# EAGLE design working (EAGLE 9.6.2)
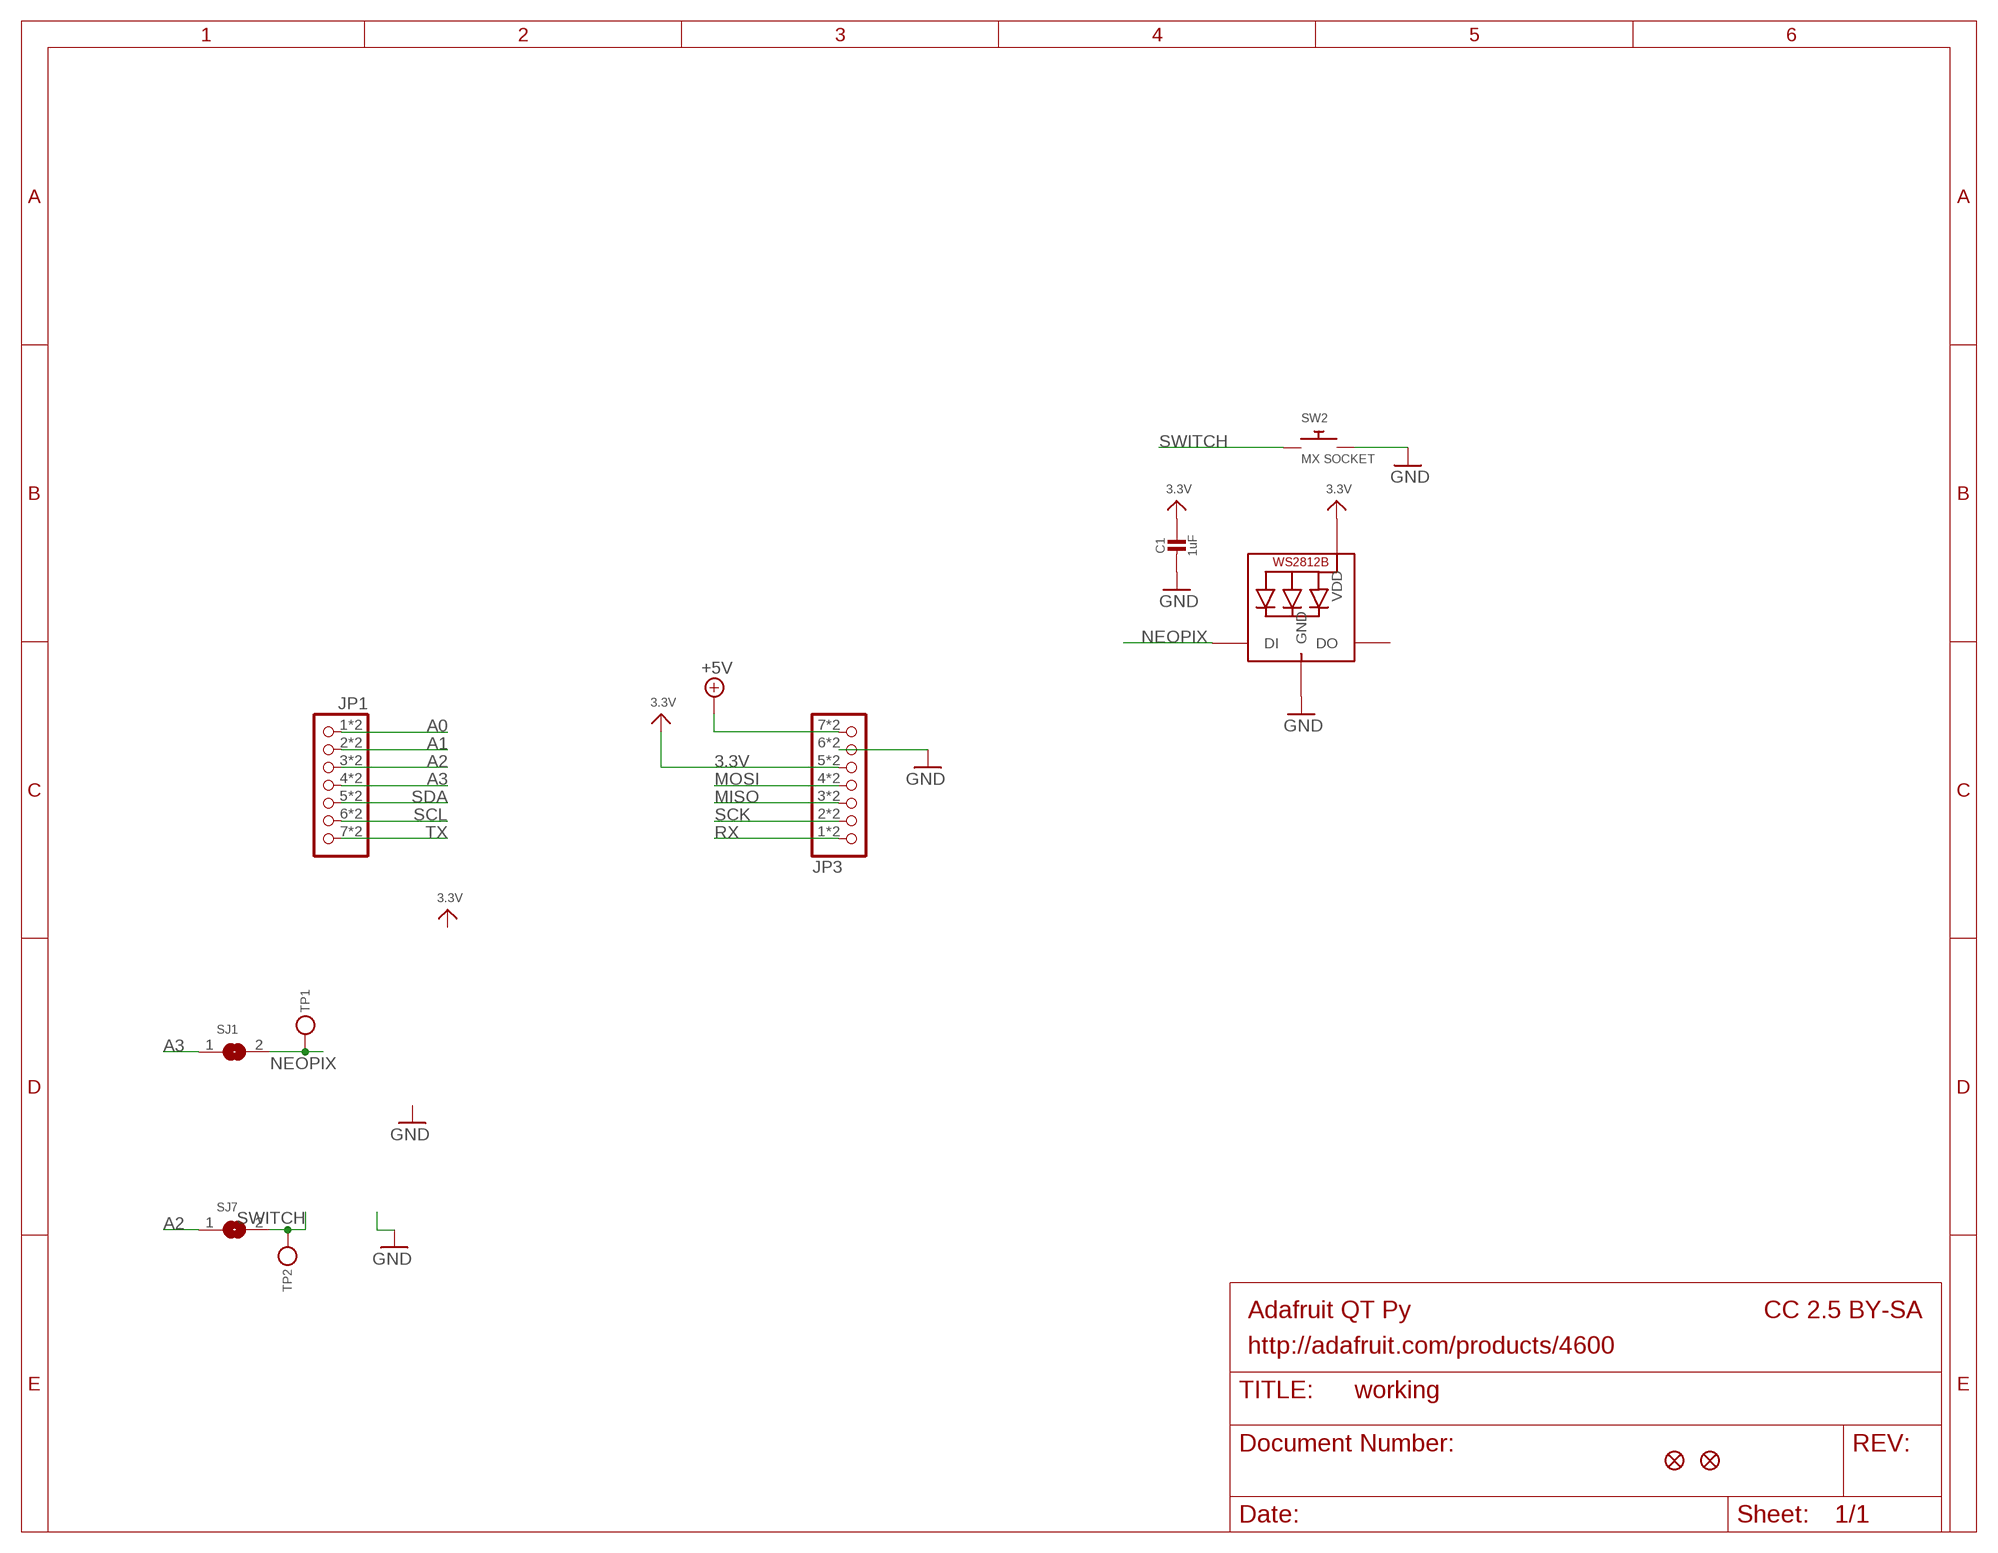
[diagram p0: schematic, sheet 1]

## Parts
C1  1uF  CAP_CERAMIC0603_NO  [0603-NO]
JP1  HEADER-1X7_CASTEL  [1X07_CASTEL]
JP3  HEADER-1X7_CASTEL  [1X07_CASTEL]
LED2  WS2812B_SK6812E  [NEO3535_REVERSE]
SJ1  SOLDERJUMPERCLOSED  [SOLDERJUMPER_CLOSEDWIRE]
SJ7  SOLDERJUMPERCLOSED  [SOLDERJUMPER_CLOSEDWIRE]
SW2  MX SOCKET  SWITCH_PUSHBUTTON_KAILH_SOCKET  [KAILH_SOCKET]
TP1  TESTPOINT1.5X2.0MM_NOCREAM  [PAD-1.5X2.0]
TP2  TESTPOINT1.5X2.0MM_NOCREAM  [PAD-1.5X2.0]
U$6  FIDUCIAL_1MM  [FIDUCIAL_1MM]
U$8  FIDUCIAL_1MM  [FIDUCIAL_1MM]

## Nets
3.3V: C1.1 JP3.5 JP3.5C LED2.1-VDD(VDD)
+5V [power]: JP3.7 JP3.7C
A0: JP1.1 JP1.1C
A1: JP1.2 JP1.2C
A2: JP1.3 JP1.3C SJ7.1
A3: JP1.4 JP1.4C SJ1.1
GND [power]: C1.2 JP3.6 JP3.6C LED2.3-GND(GND) SW2.2
MISO: JP3.3 JP3.3C
MOSI: JP3.4 JP3.4C
NEOPIX: LED2.4-DIN(DI) SJ1.2 TP1.P$1
RX: JP3.1 JP3.1C
SCK: JP3.2 JP3.2C
SCL: JP1.6 JP1.6C
SDA: JP1.5 JP1.5C
SWITCH: SJ7.2 SW2.1 TP2.P$1
TX: JP1.7 JP1.7C
Unconnected: LED2.2-DOUT(DO)

## Notes on the sheet
- Adafruit QT Py | CC 2.5 BY-SA
- http://adafruit.com/products/4600

## Library data of the parts
C1 = microbuilder:CAP_CERAMIC: Ceramic Capacitors For new designs, use the packages preceded by an '_' character since they are more reliable: The following footprints should be used on most boards: _0402 - Standard footprint for regular board layouts _0603 - Standard footprint for regular board layouts _0805 - Standard footprint for regular board layouts _1206 - Standard footprint for regular board layouts For extremely tight-pitch boards where space is at a premium, the following 'micro-pitch' footprints can be used (smaller pads, no silkscreen outline, etc.): _0402MP - Micro-pitch footprint for very dense/compact boards _0603MP - Micro-pitch footprint for very dense/compact boards _0805MP - Micro-pitch footprint for very dense/compact boards _1206MP - Micro-pitch footprint for very dense/compact boards
JP1 JP3 = adafruit_electromech:HEADER-1X7: PIN HEADER
LED2 = microbuilder:WS2812B
SJ1 SJ7 = microbuilder:SOLDERJUMPER: SMD Solder JUMPER Solder the two pads together to create a connection, or remove the solder to break it. REFLOW - Use this footprint for solder paste and reflow ovens. WAVE - Use this footprint for hand-soldering (larger pads). CLOSED - Has a trace between the two pads to ensure it is closed by default. The trace needs to be cut to disable the jumper, and can be closed again by creating a solder bridge between the two pads.
SW2 = adafruit_electromech:SWITCH_PUSHBUTTON: Buttons SOFTTOUCHSMD_SJ - Soft touch temporary push button (Super Junk Akihabara) Compatible with SKPMANE010 [Mouser: 688-SKPMAN] C&K_KSS = Digikey: KSS221GLFS; ROT: 180; XOFFSET: -.75; YOFFSET: 3.75
TP1 TP2 = microbuilder:TESTPOINT: Test Point Various test points for characterisation and PCB testing TESTPOINT_SMT - Compact Surface Mount Test Point [Digikey: 5016KTR-ND]
U$6 U$8 = microbuilder:FIDUCIAL: Fiducial Alignment Points Various fiducial points for machine vision alignment.; BOM: EXCLUDE

## Net classes
1 power: width 0.305 mm
2 thickpower: width 0.406 mm

## Board
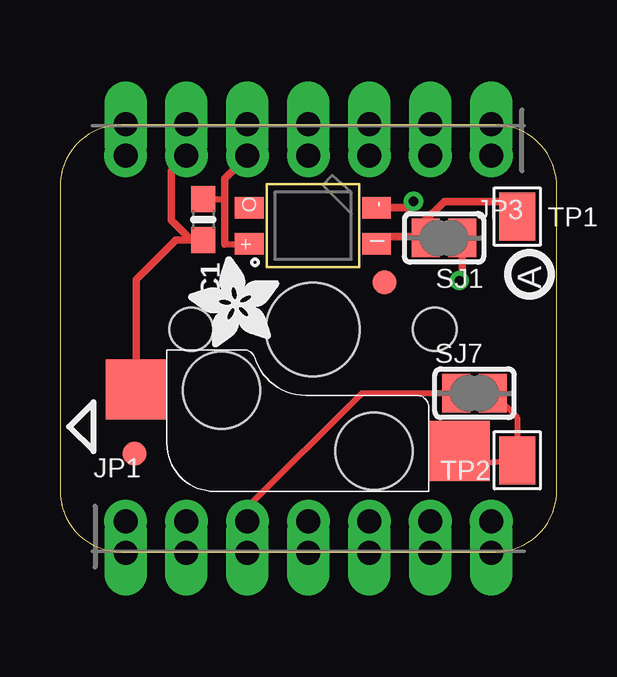
[diagram p1: board, top side]
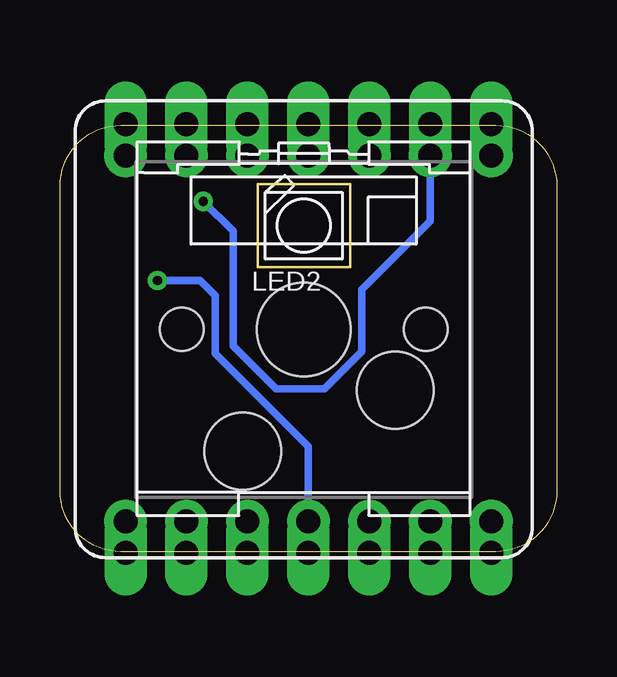
[diagram p2: board, bottom side, seen from below]

Size 20.7 x 17.78 mm. Coordinates in mm from the lower left corner, seen from the top.
Outline: 2.54,0 18.16,0 arc90 20.7,2.54 20.7,15.24 arc90 18.16,17.78 2.54,17.78 arc90 0,15.24 0,2.54 arc90 2.54,0
Copper layers (1*16): Top 0.035mm / dielectric 1.5mm / Bottom 0.035mm
Design rules "adafruit 7-7": minimum track width 7mil, minimum drill 15.5mil, track to track 7mil, track to pad 7mil, pad to pad 7mil, via to via 7mil, smd to smd 7mil, copper to edge 10mil, drill to drill 8mil, minimum pad ring 7mil, minimum via ring 8mil, stop-mask expansion 2mil, vias tented up to drill 20mil, thermal gap 10mil

### Footprints (pad centres in the part's own frame; a part is rotated, then mirrored left to right if it is on the bottom)
0603-NO = smd 1.075 x 1: 1 -0.85,0; 2 0.85,0
1X07_CASTEL = drill 1 pad 1.778: 1 -7.62,0; 2 -5.08,0; 3 -2.54,0; 4 0,0; 5 2.54,0; 6 5.08,0; 7 7.62,0 | drill 1 pad 1.778 long: 1C -7.62,-1.324; 2C -5.08,-1.324; 3C -2.54,-1.324; 4C 0,-1.324; 5C 2.54,-1.324; 6C 5.08,-1.324; 7C 7.62,-1.324
NEO3535_REVERSE = smd 1.2 x 0.9 bottom: 1-VDD 2.65,-0.75; 2-DOUT 2.65,0.75; 3-GND -2.65,0.75; 4-DIN -2.65,-0.75
SOLDERJUMPER_CLOSEDWIRE = smd 1.168 x 1.6: 1 -0.762,0; 2 0.762,0 | smd 0.635 x 0.203: WIRE 0,0
KAILH_SOCKET = smd 2.55 x 2.5 bottom: 1 6.09,5.08; 2 -7.36,2.5 | hole 3.9: 0,0 | hole 3.2: 2.54,5.08; -3.81,2.54 | hole 1.813: 5.08,0; -5.08,0
PAD-1.5X2.0 = smd 1.5 x 2: P$1 0,0
FIDUCIAL_1MM = smd 1 x 1: 1 0,0

### Placement (x,y rotation side)
C1  5.97,13.84 270 top
JP1  10.35,1.27 0 top
JP3  10.35,16.51 180 top
LED2  10.54,13.59 0 bottom
PLABEL0  [PLABEL0]  19.94,0.51 90 top
PLABEL1  [PLABEL1]  15.37,8 180 top
PLABEL2  [PLABEL2]  17.91,15.24 180 top
PLABEL3  [PLABEL3]  16.26,11.81 180 top
PLABEL4  [PLABEL4]  0.89,8.76 90 top
PLABEL5  [PLABEL5]  18.29,9.4 90 top
PLABEL6  [PLABEL6]  19.56,7.75 90 top
PLABEL7  [PLABEL7]  3.17,11.81 90 top
PLABEL8  [PLABEL8]  1.14,2.03 90 top
PLABEL9  [PLABEL9]  1.27,16.38 90 top
SJ1  16,13.08 180 top
SJ7  17.27,6.6 0 top
SW2  10.54,9.27 180 bottom
TP1  19.05,13.97 0 top
TP2  19.05,3.81 180 top
U$2  [ADAFRUIT_3.5MM]  9.14,8.51 90 top
U$3  [PCBFEAT-REV-040]  19.56,11.56 270 top
U$6  3.11,4.08 270 top
U$8  13.53,11.24 270 top

### Tracks (layer width: path | path; a pad name or v marks a point on that pad's centre or on a via)
3.3V
  Top 0.254: C1.1 6.73,14.69 6.86,14.57 6.86,12.83 7.88,12.83 LED2.1-VDD
  Top 0.305: JP3.5C JP3.5 6.86,15.56 6.86,12.83
+5V
  Top 0.305: JP3.7C JP3.7
A0
  Top 0.254: JP1.1C JP1.1
A1
  Top 0.254: JP1.2C JP1.2
A2
  Top 0.254: JP1.3C JP1.3 7.81,1.84 12.57,6.6 SJ7.1
A3  (via drill 0.39)
  Top 0.254: JP1.4C JP1.4
  Top 0.305: SJ1.1 16.76,11.43 v16.64,11.3
  Bottom 0.305: v16.64,11.3 14.86,11.3 14.22,10.67 14.22,8.25 10.35,4.38 JP1.4
GND  (via drill 0.39)
  Top 0.305: SW2.2 3.18,11.35 4.83,12.99 C1.2 5.46,12.99 4.63,13.82 4.63,15.88 JP3.6 JP3.6C | LED2.3-GND 14.47,14.34 v14.73,14.61
  Bottom 0.305: v14.73,14.61 13.49,13.36 13.49,8.58 11.69,6.79 9.69,6.79 8.13,8.35 8.13,10.92 5.27,13.78 JP3.6
MISO
  Top 0.305: JP3.3C 12.89,17.34 12.7,17.14 12.7,16.7 JP3.3
MOSI
  Top 0.305: JP3.4C JP3.4
NEOPIX
  Top 0.305: TP1.P$1 18.41,14.61 16,14.61 15.11,13.72 15.11,13.21 15.18,13.14 | 15.18,13.14 SJ1.2 | LED2.4-DIN 13.5,13.14 15.18,13.14
RX
  Top 0.305: JP3.1C JP3.1
SCK
  Top 0.305: JP3.2C JP3.2
SCL
  Top 0.254: JP1.6C JP1.6
SDA
  Top 0.254: JP1.5C 12.89,0.57 13.08,0.76 13.08,1.08 JP1.5
SWITCH
  Top 0.254: SW2.1 17.01,3.43 17.27,3.43 17.53,3.68 TP2.P$1 19.05,5.59 SJ7.2
TX
  Top 0.254: JP1.7C JP1.7

### Text on the board
Pinguin_tBackup: 5V | A0 | Neo | TX | Sw | This side to / QTPy back | A3 | BFF | NeoKey | USB | BFF | A2 | NP | A0 | RX | 5V | Sw
Pinguin_bBackup: USB | IoT Button / NeoPixel on A3 / Button on A2 / QT Py. Solder / back to / back